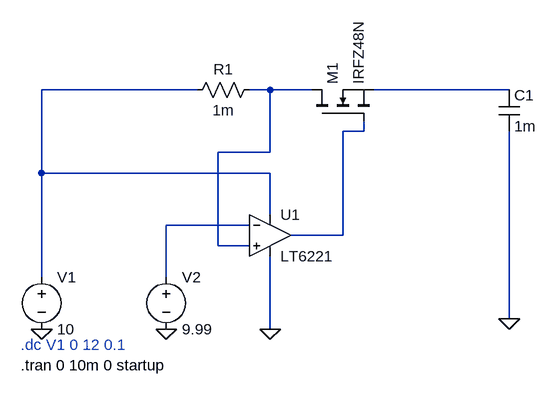
[diagram p0: schematic current_limiter.asc]
current_limiter.asc, the LTspice schematic file:
Version 4
SHEET 1 880 872
WIRE -144 80 -384 80
WIRE -32 80 -64 80
WIRE 32 80 -32 80
WIRE 336 80 128 80
WIRE 112 144 112 128
WIRE 112 144 80 144
WIRE -32 176 -32 80
WIRE -32 176 -112 176
WIRE -384 208 -384 80
WIRE -32 208 -384 208
WIRE -32 272 -32 208
WIRE -64 288 -192 288
WIRE 80 304 80 144
WIRE 80 304 0 304
WIRE -112 320 -112 176
WIRE -64 320 -112 320
WIRE -384 368 -384 208
WIRE -192 368 -192 288
WIRE 336 432 336 144
WIRE -32 448 -32 336
FLAG -384 448 0
FLAG 336 432 0
FLAG -32 448 0
FLAG -192 448 0
SYMBOL voltage -384 352 R0
WINDOW 123 0 0 Left 0
WINDOW 39 0 0 Left 0
SYMATTR InstName V1
SYMATTR Value 10
SYMBOL res -48 64 R90
WINDOW 0 0 56 VBottom 2
WINDOW 3 32 56 VTop 2
SYMATTR InstName R1
SYMATTR Value 1m
SYMBOL OpAmps\\LT6221 -32 304 R0
SYMATTR InstName U1
SYMBOL voltage -192 352 R0
WINDOW 123 0 0 Left 0
WINDOW 39 0 0 Left 0
SYMATTR InstName V2
SYMATTR Value 9.99
SYMBOL nmos 32 128 R270
SYMATTR InstName M1
SYMATTR Value IRFZ48N
SYMBOL cap 320 80 R0
SYMATTR InstName C1
SYMATTR Value 1m
TEXT -416 472 Left 2 ;.dc V1 0 12 0.1
TEXT -416 504 Left 2 !.tran 0 10m 0 startup

The netlist it stands for:
* current_limiter.asc
V1 N001 0 10
R1 N002 N001 1m
* U1: LT6221 (symbol OpAmps\LT6221 not available, pins judged from their places): In+=N002 In-=N005 V+=N001 V-=0 OUT=N004
V2 N005 0 9.99
M1 N002 N004 N003 N003 IRFZ48N
C1 N003 0 1m
.model NMOS NMOS
.model PMOS PMOS
.lib standard.mos
* .dc V1 0 12 0.1
.tran 0 10m 0 startup
.backanno
.end